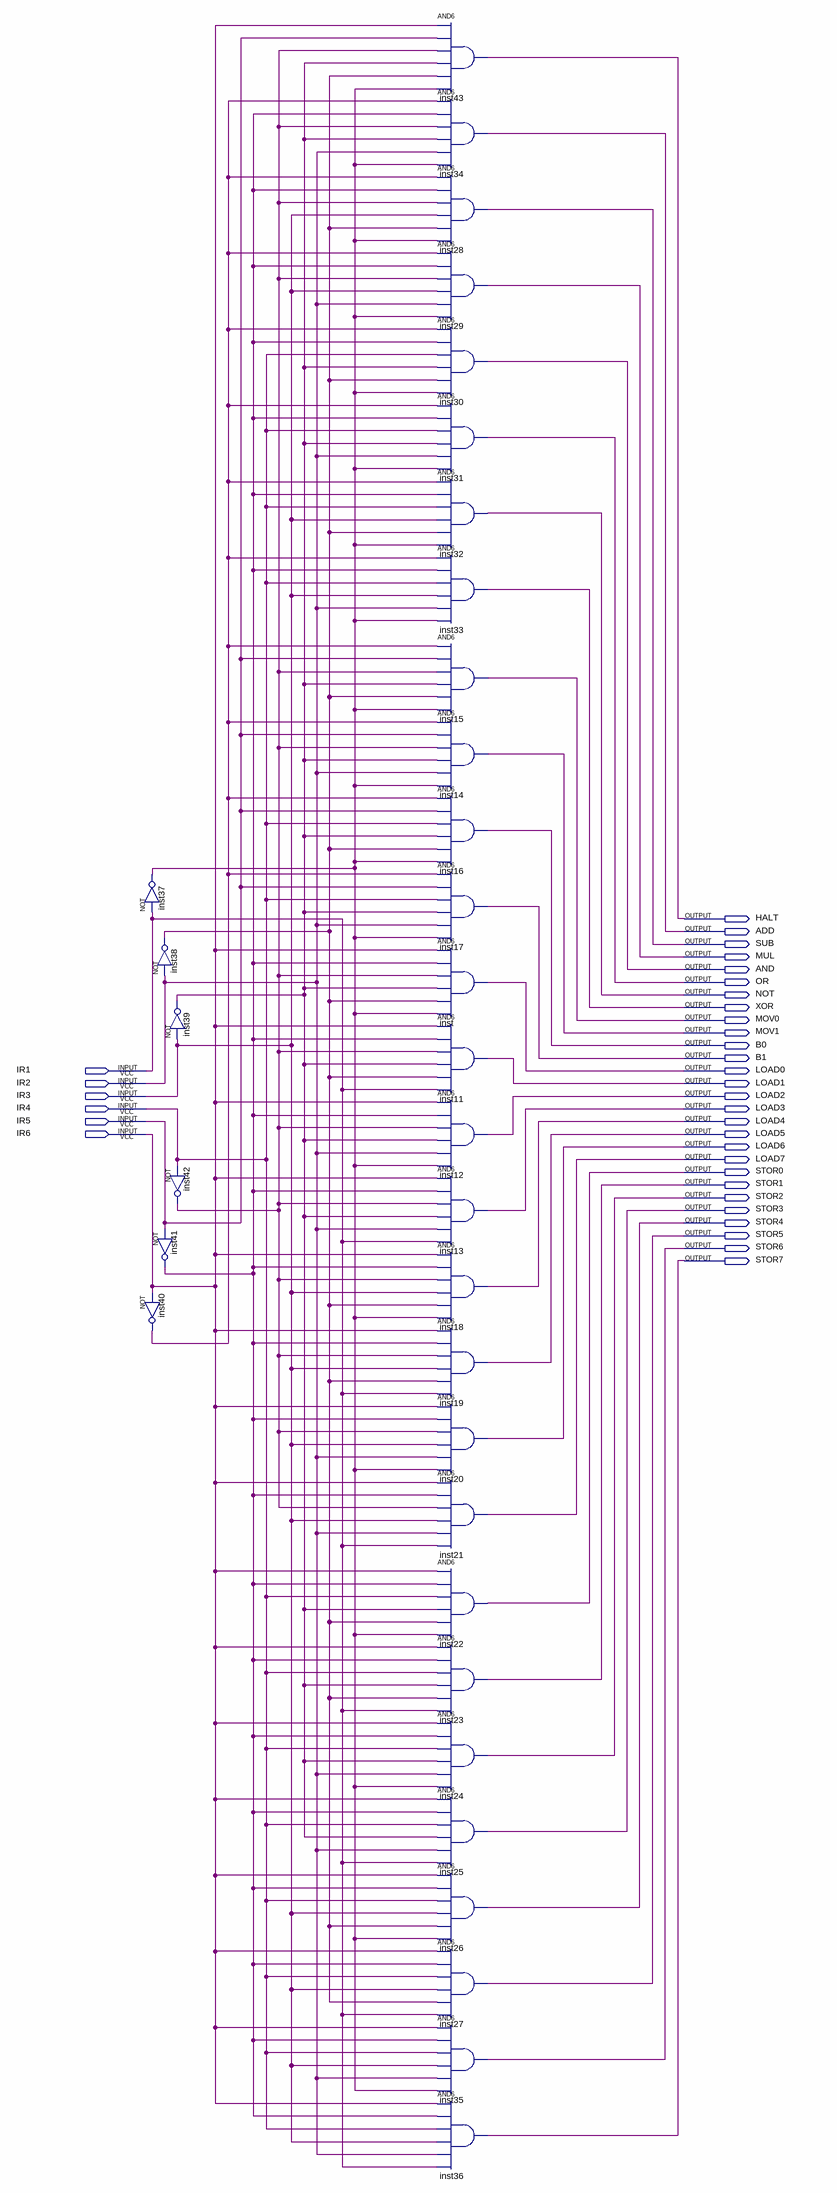
[diagram p0: schematic sheet]
// Quartus schematic op.bdf as structural Verilog: 34 symbols, 34 pins
module op (
  input  IR1,
  input  IR2,
  input  IR3,
  input  IR4,
  input  IR5,
  input  IR6,
  output HALT,
  output ADD,
  output SUB,
  output MUL,
  output AND,
  output OR,
  output NOT,
  output XOR,
  output MOV0,
  output MOV1,
  output B0,
  output B1,
  output LOAD0,
  output LOAD1,
  output LOAD2,
  output LOAD3,
  output LOAD4,
  output LOAD5,
  output LOAD6,
  output LOAD7,
  output STOR0,
  output STOR1,
  output STOR2,
  output STOR3,
  output STOR4,
  output STOR5,
  output STOR6,
  output STOR7
);

  wire inst37_out, inst38_out, inst39_out, inst40_out, inst41_out, inst42_out;

  not inst37 (inst37_out, IR1);
  not inst38 (inst38_out, IR2);
  not inst39 (inst39_out, IR3);
  not inst42 (inst42_out, IR4);
  not inst41 (inst41_out, IR5);
  not inst40 (inst40_out, IR6);
  and inst43 (HALT, IR6, IR5, inst42_out, inst39_out, inst38_out, inst37_out);
  and inst34 (ADD, inst40_out, inst41_out, inst42_out, inst39_out, IR2, inst37_out);
  and inst28 (SUB, inst40_out, inst41_out, inst42_out, IR3, inst38_out, inst37_out);
  and inst29 (MUL, inst40_out, inst41_out, inst42_out, IR3, IR2, inst37_out);
  and inst30 (AND, inst40_out, inst41_out, IR4, inst39_out, inst38_out, inst37_out);
  and inst31 (OR, inst40_out, inst41_out, IR4, inst39_out, IR2, inst37_out);
  and inst32 (NOT, inst40_out, inst41_out, IR4, IR3, inst38_out, inst37_out);
  and inst33 (XOR, inst40_out, inst41_out, IR4, IR3, IR2, inst37_out);
  and inst15 (MOV0, inst40_out, IR5, inst42_out, inst39_out, inst38_out, inst37_out);
  and inst14 (MOV1, inst40_out, IR5, inst42_out, inst39_out, IR2, inst37_out);
  and inst16 (B0, inst40_out, IR5, IR4, inst39_out, inst38_out, inst37_out);
  and inst17 (B1, inst40_out, IR5, IR4, inst39_out, IR2, inst37_out);
  and inst (LOAD0, IR6, inst41_out, inst42_out, inst39_out, inst38_out, inst37_out);
  and inst11 (LOAD1, IR6, inst41_out, inst42_out, inst39_out, inst38_out, IR1);
  and inst12 (LOAD2, IR6, inst41_out, inst42_out, inst39_out, IR2, inst37_out);
  and inst13 (LOAD3, IR6, inst41_out, inst42_out, inst39_out, IR2, IR1);
  and inst18 (LOAD4, IR6, inst41_out, inst42_out, IR3, inst38_out, inst37_out);
  and inst19 (LOAD5, IR6, inst41_out, inst42_out, IR3, inst38_out, IR1);
  and inst20 (LOAD6, IR6, inst41_out, inst42_out, IR3, IR2, inst37_out);
  and inst21 (LOAD7, IR6, inst41_out, inst42_out, IR3, IR2, IR1);
  and inst22 (STOR0, IR6, inst41_out, IR4, inst39_out, inst38_out, inst37_out);
  and inst23 (STOR1, IR6, inst41_out, IR4, inst39_out, inst38_out, IR1);
  and inst24 (STOR2, IR6, inst41_out, IR4, inst39_out, IR2, inst37_out);
  and inst25 (STOR3, IR6, inst41_out, IR4, inst39_out, IR2, IR1);
  and inst26 (STOR4, IR6, inst41_out, IR4, IR3, inst38_out, inst37_out);
  and inst27 (STOR5, IR6, inst41_out, IR4, IR3, inst38_out, IR1);
  and inst35 (STOR6, IR6, inst41_out, IR4, IR3, IR2, inst37_out);
  and inst36 (STOR7, IR6, inst41_out, IR4, IR3, IR2, IR1);
endmodule
